# EAGLE schematic voltageDivider (EAGLE 9.2.2)
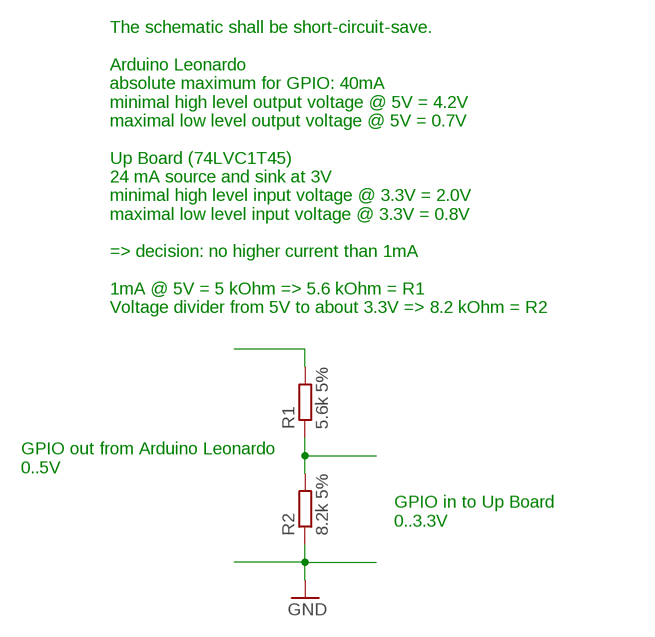
[diagram p0: schematic, sheet 1]

## Parts
R1  5.6k 5%  R-EU_0204/2V  [0204V]
R2  8.2k 5%  R-EU_0204/2V  [0204V]

## Nets
GND: R2.1
N$1: R1.1 R2.2
N$2: R1.2

## Notes on the sheet
- The schematic shall be short-circuit-save.
  
  Arduino Leonardo
  absolute maximum for GPIO: 40mA
  minimal high level output voltage @ 5V = 4.2V
  maximal low level output voltage @ 5V = 0.7V
  
  Up Board (74LVC1T45)
  24 mA source and sink at 3V
  minimal high level input voltage @ 3.3V = 2.0V
  maximal low level input voltage @ 3.3V = 0.8V
  
  => decision: no higher current than 1mA
  
  1mA @ 5V = 5 kOhm => 5.6 kOhm = R1
  Voltage divider from 5V to about 3.3V => 8.2 kOhm = R2
- GPIO out from Arduino Leonardo
  0..5V
- GPIO in to Up Board
  0..3.3V

## Library data of the parts
R1 R2 = rcl:R-EU_: RESISTOR, European symbol; SPICEPREFIX: R